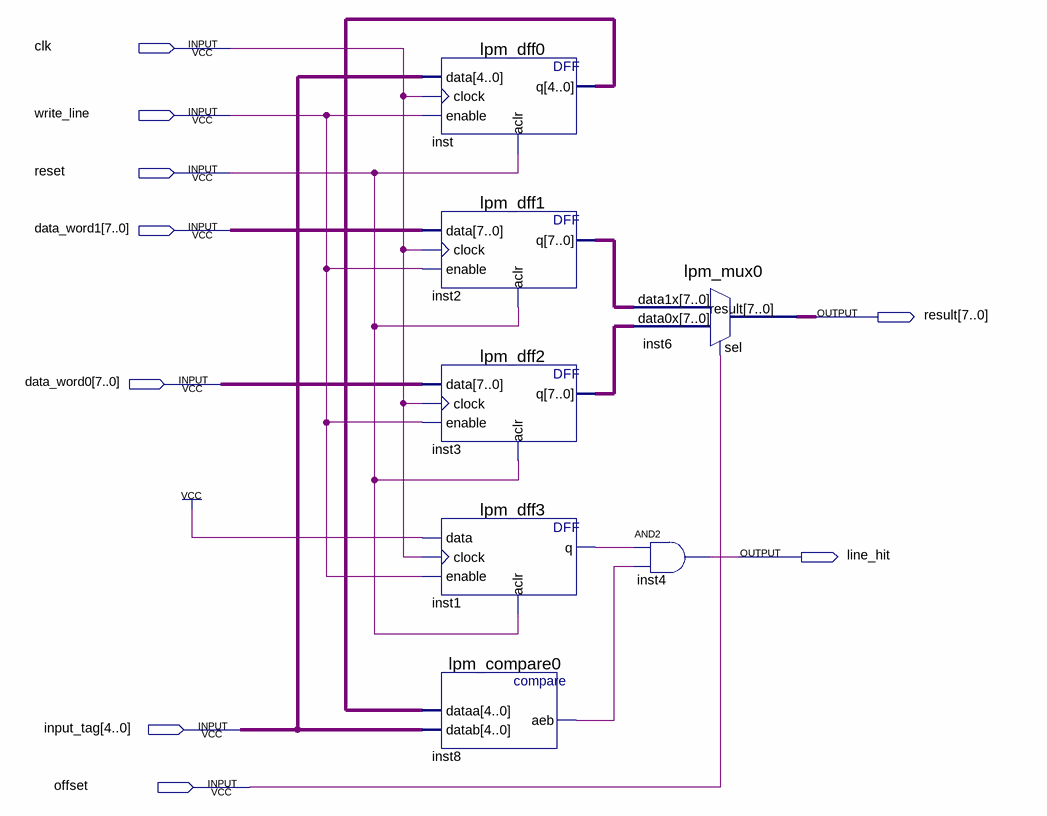
[diagram p0: schematic sheet]
// Quartus schematic cache_line.bdf as structural Verilog: 7 symbols, 9 pins
module cache_line (
  input  clk,
  input  write_line,
  input  reset,
  input  [7:0] data_word1,
  input  [7:0] data_word0,
  input  [4:0] input_tag,
  input  offset,
  output [7:0] result,
  output line_hit
);

  wire inst1_q, inst8_aeb;
  wire [4:0] inst_q;
  wire [7:0] inst2_q, inst3_q;

  lpm_dff0 inst (.data(input_tag), .clock(clk), .enable(write_line), .aclr(reset), .q(inst_q));
  lpm_dff1 inst2 (.data(data_word1), .clock(clk), .enable(write_line), .aclr(reset), .q(inst2_q));
  lpm_dff2 inst3 (.data(data_word0), .clock(clk), .enable(write_line), .aclr(reset), .q(inst3_q));
  lpm_dff3 inst1 (.data(1'b1), .clock(clk), .enable(write_line), .aclr(reset), .q(inst1_q));
  lpm_compare0 inst8 (.dataa(inst_q), .datab(input_tag), .aeb(inst8_aeb));
  lpm_mux0 inst6 (.data1x(inst2_q), .data0x(inst3_q), .sel(offset), .result(result));
  and inst4 (line_hit, inst1_q, inst8_aeb);
endmodule
